# EAGLE design Keypad_Board (EAGLE 9.6.2)
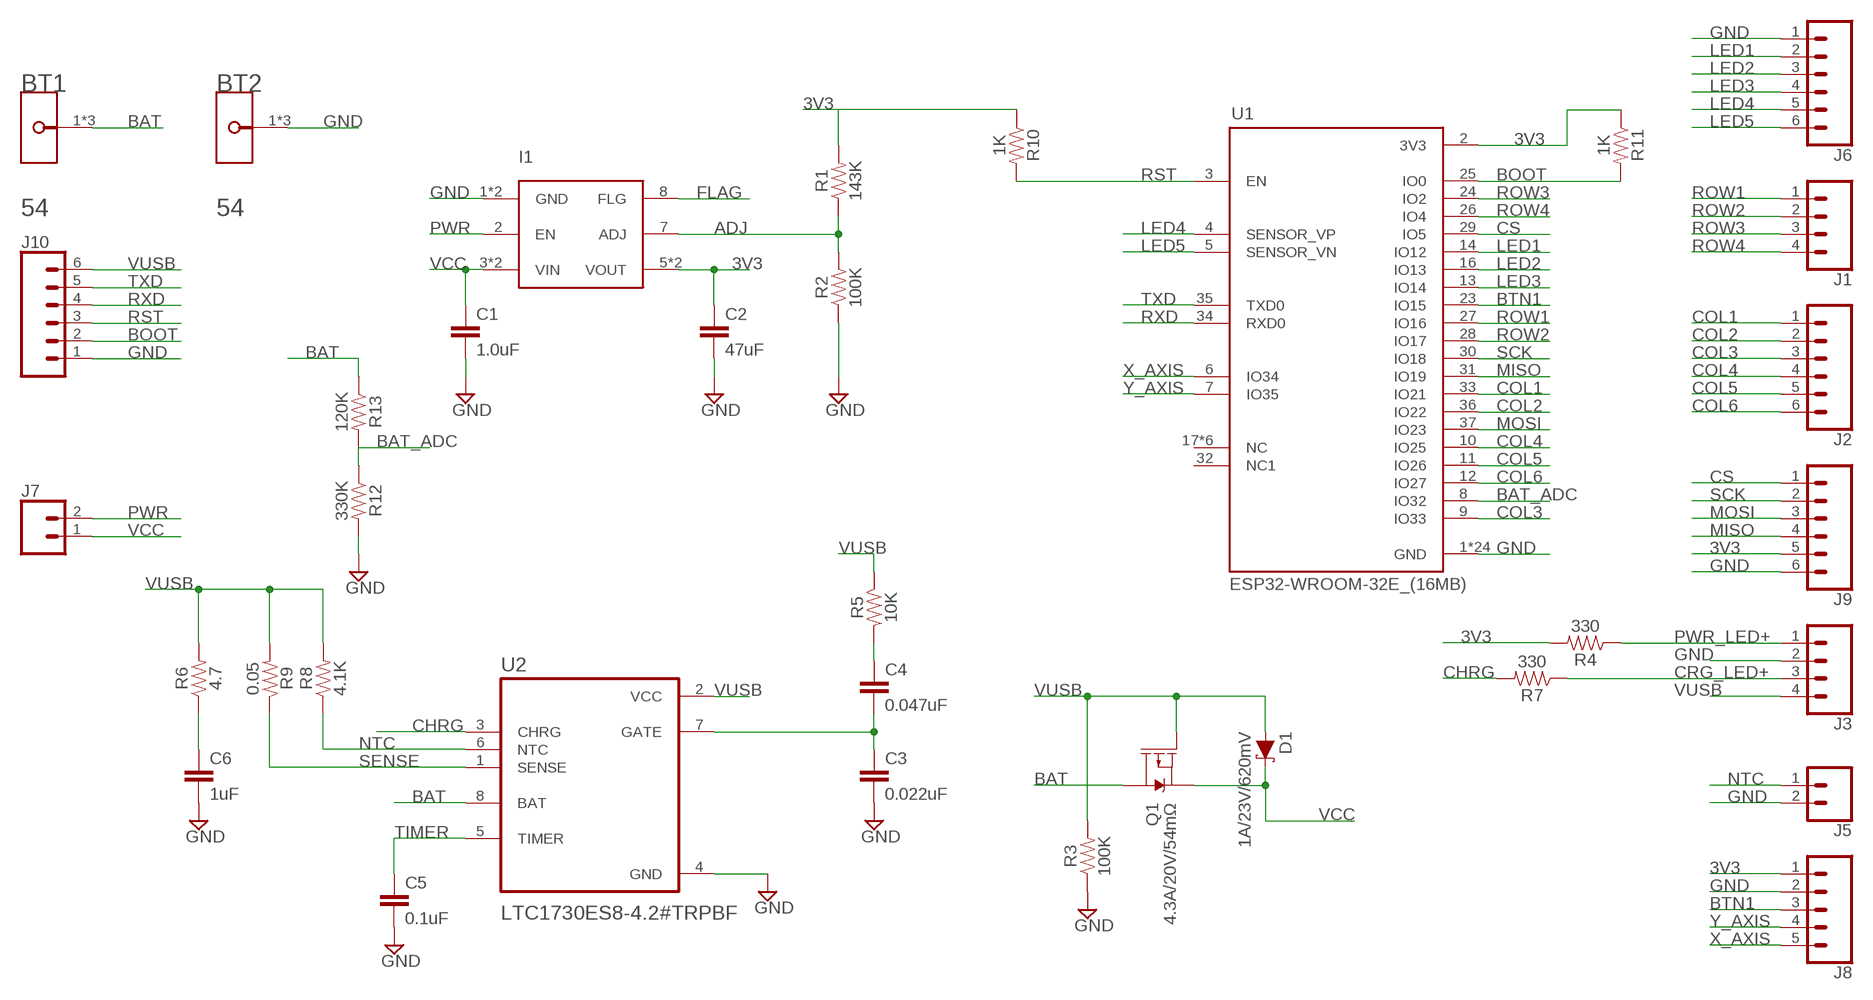
[diagram p0: schematic, sheet 1]

## Parts
BT1  KEYSTONE_54KEYSTONE_54_0_0  [KEYSTONE_54_0]
BT2  KEYSTONE_54KEYSTONE_54_0_0  [KEYSTONE_54_0]
C1  1.0uF  1.0UF-1206-50V-10%  [1206]
C2  47uF  4.7UF-1206-16V-(+80/-20%)  [1206]
C3  0.022uF  0.22UF-0603-50V-(-20/+80%)  [0603]
C4  0.047uF  0.22UF-0603-50V-(-20/+80%)  [0603]
C5  0.1uF  0.22UF-0603-50V-(-20/+80%)  [0603]
C6  1uF  0.22UF-0603-50V-(-20/+80%)  [0603]
D1  1A/23V/620mV  DIODE-SCHOTTKY-BAT20J  [SOD-323]
I1  MIC37303  [SOIC8]
J1  CONN_04  [1X04]
J2  CONN_06LOCK  [1X06_LOCK]
J3  CONN_04  [1X04]
J5  CONN_02  [1X02]
J6  CONN_06LOCK  [1X06_LOCK]
J7  CONN_02  [1X02]
J8  CONN_05  [1X05]
J9  CONN_06LOCK  [1X06_LOCK]
J10  CONN_06LOCK  [1X06_LOCK]
Q1  4.3A/20V/54mΩ  MOSFET_PCH-IRLML2244  [SOT23-3]
R1  143K  RESISTOR1206  [1206]
R2  100K  RESISTOR1206  [1206]
R3  100K  RESISTOR1206  [1206]
R4  330  0.22OHM-0805-1/4W-1%  [0805]
R5  10K  0.22OHM-0805-1/4W-1%  [0805]
R6  4.7  0.05OHM-0603-1/5W-1%  [0603]
R7  330  0.22OHM-0805-1/4W-1%  [0805]
R8  4.1K  0.05OHM-0603-1/5W-1%  [0603]
R9  0.05  0.05OHM-0603-1/5W-1%  [0603]
R10  1K  0.22OHM-0805-1/4W-1%  [0805]
R11  1K  0.22OHM-0805-1/4W-1%  [0805]
R12  330K  0.22OHM-0805-1/4W-1%  [0805]
R13  120K  0.22OHM-0805-1/4W-1%  [0805]
U1  ESP32-WROOM-32E_(16MB)  [MODULE_ESP32-WROOM-32E_(16MB)]
U2  LTC1730ES8-4.2#TRPBF  [SO-8_S]

## Nets
3V3: C2.1 I1.5(VOUT) I1.6(VOUT) J8.1 J9.5 R1.2 R4.2 R10.1 R11.1 U1.2(3V3)
ADJ: I1.7(ADJ) R1.1 R2.2
BAT: BT1.1 BT1.1-2 BT1.1-3 Q1.3(D) R13.1 U2.8(BAT)
BAT_ADC: R12.1 R13.2 U1.8(IO32)
BOOT: J10.2 R11.2 U1.25(IO0)
BTN1: J8.3 U1.23(IO15)
CHRG: R7.2 U2.3(CHRG)
COL1: J2.1 U1.33(IO21)
COL2: J2.2 U1.36(IO22)
COL3: J2.3 U1.9(IO33)
COL4: J2.4 U1.10(IO25)
COL5: J2.5 U1.11(IO26)
COL6: J2.6 U1.12(IO27)
CRG_LED+: J3.3 R7.1
CS: J9.1 U1.29(IO5)
FLAG: I1.8(FLG)
GND: BT2.1 BT2.1-2 BT2.1-3 C1.2 C2.2 C3.2 C5.2 C6.2 I1.1(GND) I1.9(GND) J3.2 J5.2 J6.1 J8.2 J9.6 J10.1 R2.1 R3.1 R12.2 U1.1(GND) U1.15(GND) U1.38(GND) U1.39_1(GND) U1.39_2(GND) U1.39_3(GND) U1.39_4(GND) U1.39_5(GND) U1.39_6(GND) U1.39_7(GND) U1.39_8(GND) U1.39_9(GND) U1.39_10(GND) U1.39_11(GND) U1.39_12(GND) U1.39_13(GND) U1.39_14(GND) U1.39_15(GND) U1.39_16(GND) U1.39_17(GND) U1.39_18(GND) U1.39_19(GND) U1.39_20(GND) U1.39_21(GND) U2.4(GND)
LED1: J6.2 U1.14(IO12)
LED2: J6.3 U1.16(IO13)
LED3: J6.4 U1.13(IO14)
LED4: J6.5 U1.4(SENSOR_VP)
LED5: J6.6 U1.5(SENSOR_VN)
MISO: J9.4 U1.31(IO19)
MOSI: J9.3 U1.37(IO23)
N$1: C4.1 R5.2
N$8: C3.1 C4.2 U2.7(GATE)
N$9: C6.1 R6.1
NTC: J5.1 R8.1 U2.6(NTC)
PWR: I1.2(EN) J7.2
PWR_LED+: J3.1 R4.1
ROW1: J1.1 U1.27(IO16)
ROW2: J1.2 U1.28(IO17)
ROW3: J1.3 U1.24(IO2)
ROW4: J1.4 U1.26(IO4)
RST: J10.3 R10.2 U1.3(EN)
RXD: J10.4 U1.34(RXD0)
SCK: J9.2 U1.30(IO18)
SENSE: R9.1 U2.1(SENSE)
TIMER: C5.1 U2.5(TIMER)
TXD: J10.5 U1.35(TXD0)
VCC: C1.1 D1.C I1.3(VIN) I1.4(VIN) J7.1 Q1.2(S)
VUSB: D1.A J3.4 J10.6 Q1.1(G) R3.2 R5.1 R6.2 R8.2 R9.2 U2.2(VCC)
X_AXIS: J8.5 U1.6(IO34)
Y_AXIS: J8.4 U1.7(IO35)
Unconnected: U1.17(NC) U1.18(NC) U1.19(NC) U1.20(NC) U1.21(NC) U1.22(NC) U1.32(NC1)

## Library data of the parts
BT1 BT2 = Keystone - 54:KEYSTONE_54: Battery Contact Clip 18650 1 Cell PC Pin; AUTOMOTIVE: No; CENTROID_NOT_SPECIFIED: No; CIIVA_IDS: 21179921; CONN_ORIENTATION: Vertical; CONTACT_MATERIAL: Tin,Nickel; DATASHEET: https://www.keyelco.com/product-pdf.cfm?p=826; DEVICE_CLASS_L1: Connectors; DEVICE_CLASS_L2: unset; DEVICE_CLASS_L3: unset; DIGIKEY_DESCRIPTION: BATTERY CONTACT CLP 18650 PC PIN; DIGIKEY_PART_NUMBER: 36-54-ND; FOOTPRINT_VARIANT_NAME_0: Recommended_Land_Pattern; IMPORTED_FROM: vault; IMPORT_TS: 1521845314; IS_FEMALE: yes; LEAD_FREE: Yes; MF: Keystone; MFG_PACKAGE_IDENT: 0; MFG_PACKAGE_IDENT_DATE: 0; MFG_PACKAGE_IDENT_REV: 0; MOUSER_PART_NUMBER: 534-54; MPN: 54; NUMBER_OF_CONTACTS: 1; OF_CELLS: 1; PACKAGE: PTH_BT_CLIP; PREFIX: BT; RELEASE_DATE: 1385110225; ROHS: Yes; VAULT_GUID: D266030C-43C5-4F65-BA5D-75E5DAEAD750; VERIFICATION_VERSION: 0.0.0.3
C1 = SparkFun-Capacitors:1.0UF: 1µF ceramic capacitors A capacitor is a passive two-terminal electrical component used to store electrical energy temporarily in an electric field.; PROD_ID: CAP-09822
C2 = SparkFun-Capacitors:4.7UF: 4.7µF ceramic capacitors A capacitor is a passive two-terminal electrical component used to store electrical energy temporarily in an electric field.; PROD_ID: CAP-10300; VALUE: 4.7uF
C3-C6 = SparkFun-Capacitors:0.22UF: 0.22µF ceramic capacitors A capacitor is a passive two-terminal electrical component used to store electrical energy temporarily in an electric field.; PROD_ID: CAP-09885; VALUE: 0.22uF
D1 = SparkFun-DiscreteSemi:DIODE-SCHOTTKY: Schottky diode A Schottky diode is a semiconductor diode which has a low forward voltage drop and a very fast switching action.; PROD_ID: DIO-11623
I1 = MIC37303:MIC37303: The MIC37300/01/02/03 is a 3.0A low-dropout linear voltage regulator that provides a low voltage, high current output with a minimum number of external components. It offers high precision, ultra-low dropout (500 mV over temperature), and low ground current. The MIC37300/01/02/03 operates from an input of 2.25V to 6.0V. It is designed to drive digital circuits requiring low-voltage at high currents (i.e., PLDs, DSP, microcontroller, etc.). It is available in fixed and adjustable output voltages. Fixed voltages include 1.5V, 1.8V, 2.5V, and 3.3V. The adjustable version is capable of 1.24V to 5.5V. Features of the MIC37300/01/02/03 LDO include thermal and current limit protection, and reverse current protection. Logic enable and error flag pins are available on the 5-pin version. Junction temperature range of the MIC37300/01/02/03 is from –40°C to +125°C. For applications requiring input voltage greater than 6.0V, see the MIC3910x, MIC3915x, MIC3930x, and MIC3950x LDOs.
J1 J3 = SparkFun-Connectors:CONN_04: Multi connection point. Often used as Generic Header-pin footprint for 0.1 inch spaced/style header connections On any of the 0.1 inch spaced packages, you can populate with these: Break Away Headers - Straight <https://www.sparkfun.com/products/116> (PRT-00116) Break Away Male Headers - Right Angle <https://www.sparkfun.com/products/553> (PRT-00553) Female Headers <https://www.sparkfun.com/products/115> (PRT-00115) Break Away Headers - Machine Pin <https://www.sparkfun.com/products/117> (PRT-00117) Break Away Female Headers - Swiss Machine Pin <https://www.sparkfun.com/products/743> (PRT-00743) For SCREWTERMINALS and SPRING TERMINALS visit here: Screw Terimnals on SparkFun.com <https://www.sparkfun.com/search/results?term=Screw+Terminals> (5mm/3.5mm/2.54mm spacing) This device is also useful as a general connection point to wire up your design to another part of your project. Our various solder wires solder well into these plated through hole pads. Hook-Up Wire - Assortment (Stranded, 22 AWG) <https://www.sparkfun.com/products/11375> (PRT-11375) Hook-Up Wire - Assortment (Solid Core, 22 AWG) <https://www.sparkfun.com/products/11367> (PRT-11367) View the entire wire category on our website here <https://www.sparkfun.com/categories/141> Special notes: Molex polarized connector foot print use with SKU : PRT-08231 with associated crimp pins and housings. 1MM SMD Version SKU: PRT-10208; PROD_ID: CONN-09696
J2 J6 J9 J10 = SparkFun-Connectors:CONN_06: Multi connection point. Often used as Generic Header-pin footprint for 0.1 inch spaced/style header connections On any of the 0.1 inch spaced packages, you can populate with these: Break Away Headers - Straight <https://www.sparkfun.com/products/116> (PRT-00116) Break Away Male Headers - Right Angle <https://www.sparkfun.com/products/553> (PRT-00553) Female Headers <https://www.sparkfun.com/products/115> (PRT-00115) Break Away Headers - Machine Pin <https://www.sparkfun.com/products/117> (PRT-00117) Break Away Female Headers - Swiss Machine Pin <https://www.sparkfun.com/products/743> (PRT-00743) Arduino Stackable Header - 6 Pin <https://www.sparkfun.com/products/9280> (PRT-09280) For SCREWTERMINALS and SPRING TERMINALS visit here: Screw Terimnals on SparkFun.com <https://www.sparkfun.com/search/results?term=Screw+Terminals> (5mm/3.5mm/2.54mm spacing) This device is also useful as a general connection point to wire up your design to another part of your project. Our various solder wires solder well into these plated through hole pads. Hook-Up Wire - Assortment (Stranded, 22 AWG) <https://www.sparkfun.com/products/11375> (PRT-11375) Hook-Up Wire - Assortment (Solid Core, 22 AWG) <https://www.sparkfun.com/products/11367> (PRT-11367) View the entire wire category on our website here <https://www.sparkfun.com/categories/141>
J5 J7 = SparkFun-Connectors:CONN_02: Multi connection point. Often used as Generic Header-pin footprint for 0.1 inch spaced/style header connections On any of the 0.1 inch spaced packages, you can populate with these: Break Away Headers - Straight <https://www.sparkfun.com/products/116> (PRT-00116) Break Away Male Headers - Right Angle <https://www.sparkfun.com/products/553> (PRT-00553) Female Headers <https://www.sparkfun.com/products/115> (PRT-00115) Break Away Headers - Machine Pin <https://www.sparkfun.com/products/117> (PRT-00117) Break Away Female Headers - Swiss Machine Pin <https://www.sparkfun.com/products/743> (PRT-00743) For SCREWTERMINALS and SPRING TERMINALS visit here: Screw Terimnals on SparkFun.com <https://www.sparkfun.com/search/results?term=Screw+Terminals> (5mm/3.5mm/2.54mm spacing) This device is also useful as a general connection point to wire up your design to another part of your project. Our various solder wires solder well into these plated through hole pads. Hook-Up Wire - Assortment (Stranded, 22 AWG) <https://www.sparkfun.com/products/11375> (PRT-11375) Hook-Up Wire - Assortment (Solid Core, 22 AWG) <https://www.sparkfun.com/products/11367> (PRT-11367) View the entire wire category on our website here <https://www.sparkfun.com/categories/141> Special notes: Molex polarized connector foot print use with: PRT-08233 with associated crimp pins and housings. 2.54_SCREWTERM for use with PRT-10571. 3.5mm Screw Terminal footprints for PRT-08084 5mm Screw Terminal footprints for use with PRT-08432
J8 = SparkFun-Connectors:CONN_05: Multi connection point. Often used as Generic Header-pin footprint for 0.1 inch spaced/style header connections On any of the 0.1 inch spaced packages, you can populate with these: Break Away Headers - Straight <https://www.sparkfun.com/products/116> (PRT-00116) Break Away Male Headers - Right Angle <https://www.sparkfun.com/products/553> (PRT-00553) Female Headers <https://www.sparkfun.com/products/115> (PRT-00115) Break Away Headers - Machine Pin <https://www.sparkfun.com/products/117> (PRT-00117) Break Away Female Headers - Swiss Machine Pin <https://www.sparkfun.com/products/743> (PRT-00743) For SCREWTERMINALS and SPRING TERMINALS visit here: Screw Terimnals on SparkFun.com <https://www.sparkfun.com/search/results?term=Screw+Terminals> (5mm/3.5mm/2.54mm spacing) This device is also useful as a general connection point to wire up your design to another part of your project. Our various solder wires solder well into these plated through hole pads. Hook-Up Wire - Assortment (Stranded, 22 AWG) <https://www.sparkfun.com/products/11375> (PRT-11375) Hook-Up Wire - Assortment (Solid Core, 22 AWG) <https://www.sparkfun.com/products/11367> (PRT-11367) View the entire wire category on our website here <https://www.sparkfun.com/categories/141> Special notes: Molex polarized connector foot print use with SKU : PRT-08231 with associated crimp pins and housings. 1MM SMD Version SKU: PRT-10208
Q1 = SparkFun-DiscreteSemi:MOSFET_PCH: P-channel MOSFETs Voltage controlled devices that allow control of high current outputs. SparkFun Products: SparkFun ESP32 Thing <https://www.sparkfun.com/products/13907> SparkFun ESP8266 Thing <https://www.sparkfun.com/products/13231>; PROD_ID: TRANS-11153
R1-R3 = SparkFun-Resistors:RESISTOR: Generic Resistor Package
R4 R5 R7 R10-R13 = SparkFun-Resistors:0.22OHM: 0.22Ω resistor A resistor is a passive two-terminal electrical component that implements electrical resistance as a circuit element. Resistors act to reduce current flow, and, at the same time, act to lower voltage levels within circuits. - Wikipedia; PROD_ID: RES-09883; VALUE: 0.22
R6 R8 = SparkFun-Resistors:0.05OHM: 0.05Ω resistor A resistor is a passive two-terminal electrical component that implements electrical resistance as a circuit element. Resistors act to reduce current flow, and, at the same time, act to lower voltage levels within circuits. - Wikipedia; PROD_ID: RES-12535; VALUE: 0.05
R9 = SparkFun-Resistors:0.05OHM: 0.05Ω resistor A resistor is a passive two-terminal electrical component that implements electrical resistance as a circuit element. Resistors act to reduce current flow, and, at the same time, act to lower voltage levels within circuits. - Wikipedia; PROD_ID: RES-12535
U1 = ESP32-WROOM-32E__16MB_:ESP32-WROOM-32E_(16MB): Bluetooth, WiFi 802.11b/g/n, Bluetooth v4.2 +EDR, Class 1, 2 and 3 Transceiver Module 2.4GHz ~ 2.5GHz Integrated, Trace Surface Mount; AVAILABILITY: Unavailable; DESCRIPTION: Bluetooth, WiFi 802.11b/g/n, Bluetooth v4.2 +EDR, Class 1, 2 and 3 Transceiver Module 2.4GHz ~ 2.5GHz Integrated, Trace Surface Mount; MF: Espressif Systems; MP: ESP32-WROOM-32E (16MB); PACKAGE: Module Espressif Systems; PRICE: None
U2 = LTC1730ES8:LTC1730ES8-4.2#TRPBF: None Check prices <https://pricing.snapeda.com/parts/LTC1730ES8-4.2%23TRPBF/Analog%20Devices/view-part?ref=eda>; AVAILABILITY: Bad; DESCRIPTION: Pulse Battery Charger Li-Ion/Li-Pol 1000mA 4.2V 8-Pin SOIC N T/R; MF: Analog Devices; MP: LTC1730ES8-4.2#TRPBF; PACKAGE: SOIC -8 Analog Devices; PRICE: None

## Board
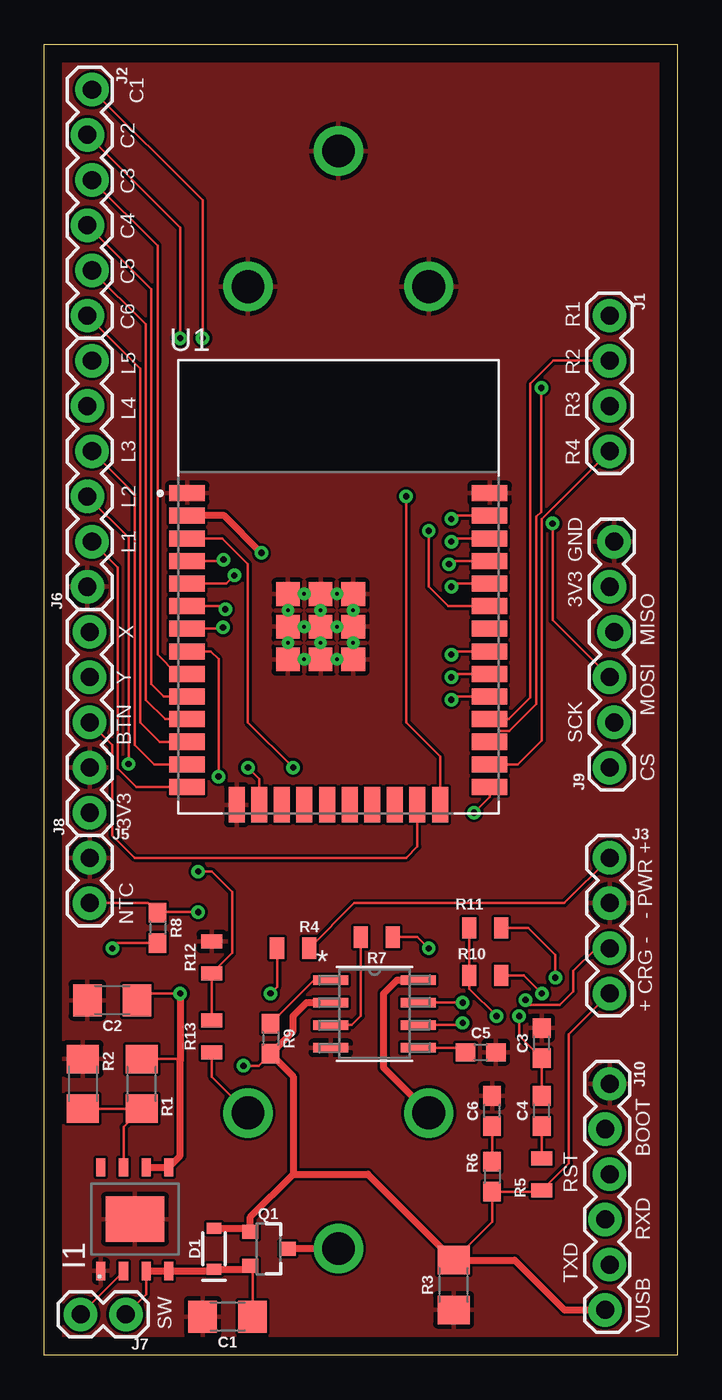
[diagram p1: board, top side]
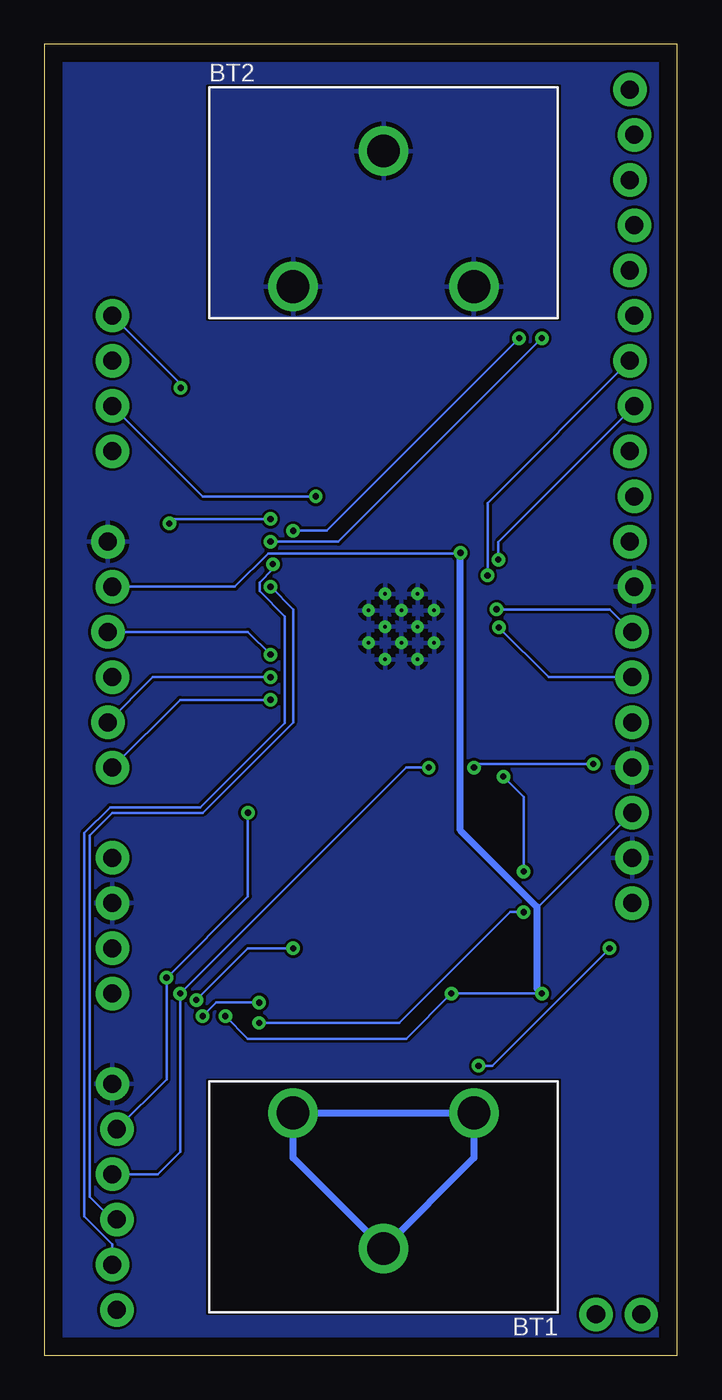
[diagram p2: board, bottom side, seen from below]

Size 35.56 x 73.66 mm. Coordinates in mm from the lower left corner, seen from the top.
Outline: 0,73.66 35.56,73.66 35.56,0 0,0 0,73.66
Copper layers (1*16): Top 0.035mm / dielectric 1.5mm / Bottom 0.035mm
Design rules "OSH_Park_DesignRules": minimum track width 6mil, minimum drill 0.35mm, track to track 6mil, track to pad 6mil, pad to pad 6mil, via to via 6mil, smd to smd 6mil, copper to edge 40mil, drill to drill 6mil, minimum pad ring 10mil, minimum via ring 8mil, stop-mask expansion 4mil, vias tented up to drill 0mil, thermal gap 10mil

### Footprints (pad centres in the part's own frame; a part is rotated, then mirrored left to right if it is on the bottom)
KEYSTONE_54_0 = drill 1.83 pad 2.78: 1 0,2.9; 1-2 -5.08,-4.72; 1-3 5.08,-4.72
1206 = smd 1.6 x 1.8: 1 -1.4,0; 2 1.4,0
0603 = smd 1.1 x 1: 1 -0.85,0; 2 0.85,0
SOD-323 = smd 0.63 x 0.83: A 1.15,0; C -1.15,0
SOIC8 = smd 1.016 x 0.508: 1 -2.9,1.91; 2 -2.9,0.64; 3 -2.9,-0.63; 4 -2.9,-1.9; 5 2.94,-1.9; 6 2.94,-0.63; 7 2.94,0.64; 8 2.94,1.91 | smd 2.54 x 3.3: 9 0.02,0
1X04 = drill 1.016 pad 1.88: 1 0,0; 2 2.54,0; 3 5.08,0; 4 7.62,0
1X06_LOCK = drill 1.016 pad 1.88: 1 0,0; 2 2.54,-0.254; 3 5.08,0; 4 7.62,-0.254; 5 10.16,0; 6 12.7,-0.254
1X02 = drill 1.016 pad 1.88: 1 0,0; 2 2.54,0
1X05 = drill 1.016 pad 1.88: 1 0,0; 2 2.54,0; 3 5.08,0; 4 7.62,0; 5 10.16,0
SOT23-3 = smd 0.8 x 0.9: 1 -0.95,-1; 2 0.95,-1; 3 0,1.1
0805 = smd 0.8 x 1.2: 1 -0.9,0; 2 0.9,0
MODULE_ESP32-WROOM-32E_(16MB) = smd 2 x 0.9: 1 -8.5,5.26; 2 -8.5,3.99; 3 -8.5,2.72; 4 -8.5,1.45; 5 -8.5,0.18; 6 -8.5,-1.09; 7 -8.5,-2.36; 8 -8.5,-3.63; 9 -8.5,-4.9; 10 -8.5,-6.17; 11 -8.5,-7.44; 12 -8.5,-8.71; 13 -8.5,-9.98; 14 -8.5,-11.25; 25 8.5,-11.25; 26 8.5,-9.98; 27 8.5,-8.71; 28 8.5,-7.44; 29 8.5,-6.17; 30 8.5,-4.9; 31 8.5,-3.63; 32 8.5,-2.36; 33 8.5,-1.09; 34 8.5,0.18; 35 8.5,1.45; 36 8.5,2.72; 37 8.5,3.99; 38 8.5,5.26 | smd 0.9 x 2: 15 -5.715,-12.25; 16 -4.445,-12.25; 17 -3.175,-12.25; 18 -1.905,-12.25; 19 -0.635,-12.25; 20 0.635,-12.25; 21 1.905,-12.25; 22 3.175,-12.25; 23 4.445,-12.25; 24 5.715,-12.25 | smd 1.33 x 1.33: 39_1 -2.835,-0.405; 39_2 -1,-0.405; 39_3 0.835,-0.405; 39_4 -2.835,-2.24; 39_5 -1,-2.24; 39_6 0.835,-2.24; 39_7 -2.835,-4.075; 39_8 -1,-4.075; 39_9 0.835,-4.075 | drill 0.2 pad 0.3: 39_10 -1.917,-0.405; 39_11 -0.083,-0.405; 39_12 -2.835,-1.323; 39_13 -1,-1.323; 39_14 0.835,-1.323; 39_15 -1.917,-2.24; 39_16 -0.083,-2.24; 39_17 -2.835,-3.158; 39_18 -1,-3.158; 39_19 0.835,-3.158; 39_20 -1.917,-4.075; 39_21 -0.083,-4.075
SO-8_S = smd 1.981 x 0.533: 1 -2.464,1.905; 2 -2.464,0.635; 3 -2.464,-0.635; 4 -2.464,-1.905; 5 2.464,-1.905; 6 2.464,-0.635; 7 2.464,0.635; 8 2.464,1.905

### Placement (x,y rotation side)
BT1  16.51,8.89 180 bottom
BT2  16.51,64.77 0 bottom
C1  10.29,2.16 180 top
C2  3.81,19.94 180 top
C3  27.94,17.53 90 top
C4  27.94,13.72 90 top
C5  24.51,17.02 0 top
C6  25.15,13.72 90 top
D1  9.53,5.97 90 top
I1  5.08,7.62 90 top
J1  31.75,58.42 270 top
J2  2.67,71.12 270 top
J3  31.75,27.94 270 top
J5  2.54,25.4 90 top
J6  2.41,43.18 90 top
J7  4.57,2.29 180 top
J8  2.54,30.48 90 top
J9  31.75,33.02 90 top
J10  31.75,15.24 270 top
Q1  12.57,5.97 270 top
R1  5.46,15.24 90 top
R2  2.16,15.24 270 top
R3  22.99,3.94 90 top
R4  13.97,22.86 180 top
R5  27.94,10.16 90 top
R6  25.15,10.03 270 top
R7  18.67,23.49 180 top
R8  6.35,24 270 top
R9  12.7,17.78 270 top
R10  24.77,21.34 0 top
R11  24.77,24 0 top
R12  9.4,22.35 90 top
R13  9.4,17.91 90 top
U1  16.51,43.18 0 top
U2  18.54,19.18 0 top

### Tracks (layer width: path | path; a pad name or v marks a point on that pad's centre or on a via)
3V3  (via drill 0.35)
  Top 0.152: R1.2 7.49,16.64 7.62,16.51 | C2.1 5.59,20.32 v7.62,20.32 | R4.2 13.07,20.69 v12.7,20.32 | v25.4,19.05 23.87,20.59 R10.1 R11.1
  Top 0.406: I1.6 I1.5 7.62,11.2 7.62,16.51 v7.62,20.32 | v12.19,45.09 10.11,47.17 U1.2
  Bottom 0.152: v7.62,20.32 v12.7,20.32 15.24,17.78 24.13,17.78 v25.4,19.05 | J9.5 24.86,43.18 22.98,45.06 12.22,45.06 v12.19,45.09 | J8.1 7.82,25.2 7.9,25.2
  Bottom 0.406: v12.19,45.09 12.19,29.49 7.9,25.2 7.9,20.6 v7.62,20.32
ADJ
  Top 0.152: R2.2 R1.1 4.44,12.82 I1.7
BAT
  Top 0.152: BT1.1-2 9.4,15.64 R13.1
  Top 0.406: BT1.1-3 19.05,16.15 19.05,20.32 19.81,21.08 U2.8 | Q1.3 13.69,5.99 BT1.1
  Bottom 0.406: BT1.1-2 11.43,11.07 BT1.1 21.59,11.07 BT1.1-3 BT1.1-2
BAT_ADC  (via drill 0.35)
  Top 0.152: R13.2 R12.1 10.54,22.59 10.54,26.04 9.4,27.18 v8.64,27.18 | v9.78,32.51 9.78,39.12 9.34,39.55 U1.8
  Bottom 0.152: v8.64,27.18 8.64,31.37 v9.78,32.51
BOOT  (via drill 0.35)
  Top 0.152: v28.7,21.21 28.7,22.48 27.18,24 R11.2 | v24.13,30.48 25.01,31.36 U1.25
  Bottom 0.152: J10.2 28.7,15.49 v28.7,21.21 24.13,25.78 v24.13,30.48
BTN1
  Top 0.152: J8.3 3.81,34.29 3.81,29.21 5.08,27.94 20.32,27.94 20.95,28.57 U1.23
CHRG
  Top 0.152: U2.3 17.27,18.54 17.78,19.05 R7.2
COL1  (via drill 0.35)
  Top 0.152: J2.1 8.89,64.9 v8.89,57.15 | v21.59,46.33 21.59,43.18 22.68,42.09 U1.33
  Bottom 0.152: v8.89,57.15 19.71,46.33 v21.59,46.33
COL2  (via drill 0.35)
  Top 0.152: J2.2 7.62,63.37 v7.62,57.15 | v22.86,45.72 23.04,45.9 U1.36
  Bottom 0.152: v7.62,57.15 19.05,45.72 v22.86,45.72
COL3
  Top 0.152: U1.9 7.44,38.28 6.35,39.37 6.35,62.36 J2.3
COL4
  Top 0.152: U1.10 6.7,37.01 5.99,37.72 5.99,59.92 J2.4
COL5
  Top 0.152: U1.11 6.78,35.74 5.69,36.83 5.69,57.94 J2.5
COL6
  Top 0.152: U1.12 6.48,34.47 5.39,35.56 5.39,55.45 J2.6
CRG_LED+  (via drill 0.35)
  Top 0.152: R7.1 20.95,23.49 v21.59,22.86 | v27.03,19.96 27.31,19.68 28.96,19.68 29.72,20.45 29.72,21.59 30.99,22.86 J3.3
  Bottom 0.152: v21.59,22.86 24.13,22.86 v27.03,19.96
CS  (via drill 0.35)
  Top 0.152: v22.86,36.83 23.04,37.01 U1.29
  Bottom 0.152: J9.1 27.94,36.83 v22.86,36.83
GND
  pour Bottom: 0,73.66 0,0 35.56,0 35.56,73.66
  pour Top: 0,73.66 35.56,73.66 35.56,0 0,0
LED1
  Top 0.152: U1.14 5.15,31.93 4.12,32.97 4.12,44.27 J6.2
LED2  (via drill 0.35)
  Top 0.152: v4.72,33.22 4.72,45.95 J6.3 | v11.43,33.02 12.06,32.38 U1.16
  Bottom 0.152: v4.72,33.22 11.23,33.22 v11.43,33.02
LED3
  Top 0.152: U1.13 6.17,33.2 5.08,34.29 5.08,48.39 J6.4
LED4  (via drill 0.35)
  Top 0.152: v10.06,44.7 9.99,44.63 U1.4
  Bottom 0.152: v10.06,44.7 10.06,45.69 J6.5
LED5  (via drill 0.35)
  Top 0.152: U1.5 10.21,43.36 v10.67,43.82
  Bottom 0.152: J6.6 10.67,47.88 v10.67,43.82
MISO  (via drill 0.35)
  Top 0.152: v22.86,39.37 23.04,39.55 U1.31
  Bottom 0.152: J9.4 24.13,40.64 v22.86,39.37
MOSI  (via drill 0.35)
  Top 0.152: J9.3 28.55,41.3 v28.55,46.74 | v22.86,46.99 23.04,47.17 U1.37
  Bottom 0.152: v28.55,46.74 28.29,46.99 v22.86,46.99
N$1
  Top 0.152: R5.2 C4.1
N$8  (via drill 0.35)
  Top 0.152: C4.2 C3.1 26.67,17.95 v26.67,19.05 | v23.5,19.81 U2.7
  Bottom 0.152: v26.67,19.05 25.91,19.81 v23.5,19.81
N$9
  Top 0.152: R6.1 C6.1
NTC  (via drill 0.35)
  Top 0.152: J5.1 5.8,25.4 R8.1 6.39,24.89 v8.64,24.89 | U2.6 23.37,18.54 v23.5,18.67
  Bottom 0.152: v23.5,18.67 15.62,18.67 9.4,24.89 v8.64,24.89
PWR
  Top 0.152: J7.2 4.44,4.69 I1.2
PWR_LED+
  Top 0.152: R4.1 17.41,25.4 29.21,25.4 J3.1
ROW1  (via drill 0.35)
  Top 0.152: U1.27 25.6,35.06 26.11,35.06 27.64,36.59 27.64,47.12 27.91,47.39 v27.91,54.36
  Bottom 0.152: v27.91,54.36 27.91,54.58 J1.1
ROW2
  Top 0.152: U1.28 26.09,35.74 27.31,36.96 27.31,54.61 28.58,55.88 J1.2
ROW3  (via drill 0.35)
  Top 0.152: v20.32,48.26 20.32,35.56 22.23,33.65 U1.24
  Bottom 0.152: J1.3 26.67,48.26 v20.32,48.26
ROW4
  Top 0.152: J1.4 27.94,46.99 27.94,34.54 26.6,33.2 U1.26
RST  (via drill 0.35)
  Top 0.152: R10.2 26.92,21.34 v27.94,20.32 | U1.3 9.98,45.9 11.43,44.45 11.43,35.56 v13.97,33.02
  Bottom 0.152: J10.3 29.21,10.16 27.94,11.43 v27.94,20.32 15.24,33.02 v13.97,33.02
RXD  (via drill 0.35)
  Top 0.152: U1.34 23.04,43.36 v22.86,43.18
  Bottom 0.152: v22.86,43.18 21.59,41.91 21.59,35.56 26.67,30.48 31.75,30.48 33.02,29.21 33.02,8.89 31.75,7.62 J10.4
SCK  (via drill 0.35)
  Top 0.152: v22.86,38.1 23.04,38.28 U1.30
  Bottom 0.152: J9.2 29.46,38.1 v22.86,38.1
SENSE
  Top 0.152: R9.1 15.15,21.08 U2.1
TIMER
  Top 0.152: U2.5 23.41,17.27 C5.1
TXD  (via drill 0.35)
  Top 0.152: v22.73,44.45 22.91,44.63 U1.35
  Bottom 0.152: J10.5 31.75,6.22 33.33,7.8 33.33,29.34 31.88,30.79 26.8,30.79 22.06,35.52 22.06,41.52 23.47,42.93 23.47,43.43 22.73,44.16 v22.73,44.45
VCC
  Top 0.152: J7.1 5.71,3.42 I1.3 | C1.1 11.69,4.91 Q1.2
  Top 0.406: I1.3 I1.4 9.43,4.72 D1.C 11.37,4.82 Q1.2
VUSB  (via drill 0.35)
  Top 0.152: R3.2 25.15,7.5 R6.2 27.86,9.18 R5.1 29.46,10.78 29.46,18.03 J3.4 | R9.2 12.03,16.26 v11.18,16.26 | v3.81,22.86 4.1,23.15 R8.2
  Top 0.406: 13.97,10.16 18.16,10.16 R3.2 26.41,5.34 29.21,2.54 J10.6 | U2.2 14.73,19.81 13.97,19.05 13.97,18.2 R9.2 13.97,15.66 13.97,10.16 | D1.A 11.37,7.12 Q1.1 11.57,7.76 13.97,10.16
  Bottom 0.152: v11.18,16.26 10.41,16.26 v3.81,22.86
X_AXIS  (via drill 0.35)
  Top 0.152: v10.16,41.91 9.98,42.09 U1.6
  Bottom 0.152: J8.5 3.81,41.91 v10.16,41.91
Y_AXIS  (via drill 0.35)
  Top 0.152: U1.7 9.96,40.82 v10.03,40.89
  Bottom 0.152: v10.03,40.89 7.24,38.1 J8.4

### Text on the board
tNames: C1 | C2 | C3 | C4 | C5 | C6 | R1 | L5 | R2 | L4 | R3 | L3 | R4 | L2 | L1 | GND | 3V3 | X | MISO | Y | BTN | MOSI | SCK | 3V3 | CS | NTC | - PWR + | + CRG - | BOOT | RST | RXD | TXD | SW | VUSB